# EAGLE schematic Western Aero 2020 (EAGLE 9.4.2)
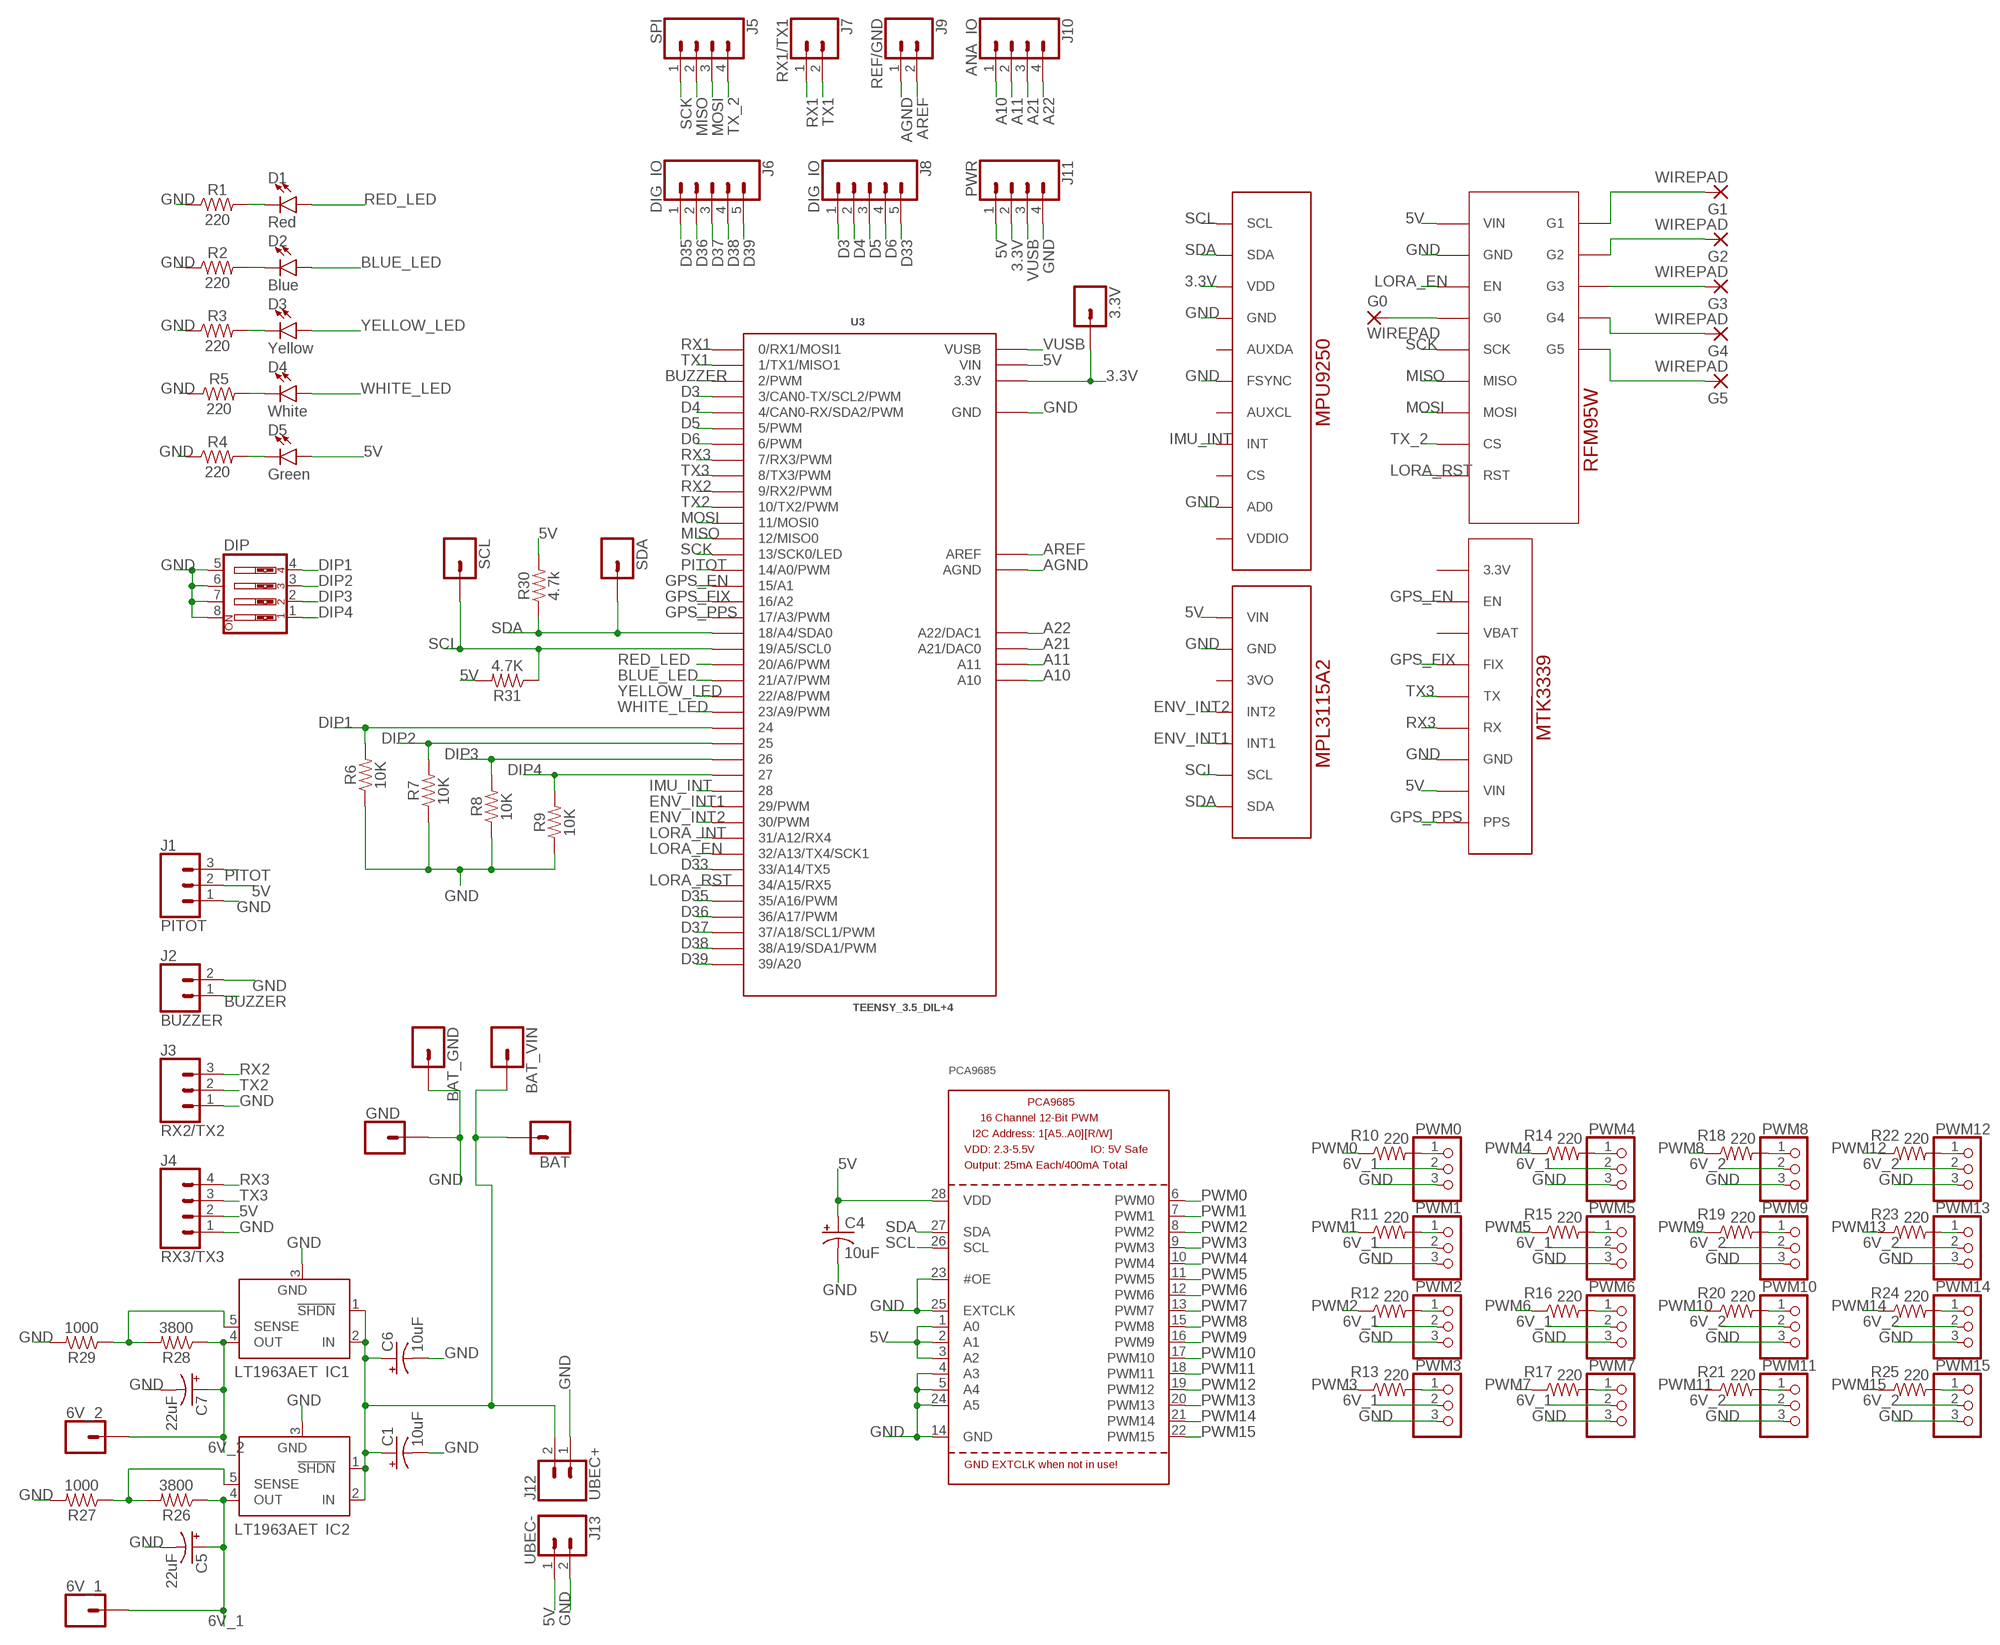
[diagram p0: schematic, sheet 1]

## Parts
3.3V  CONN_01  [1X01]
6V_1  CONN_01  [1X01]
6V_2  CONN_01  [1X01]
BAT  CONN_01  [1X01]
BAT_GND  CONN_01  [1X01]
BAT_VIN  CONN_01  [1X01]
C1  10uF  10UF-POLAR-RADIAL-2.5MM-25V-20%  [CPOL-RADIAL-2.5MM-5MM]
C4  10uF  10UF-POLAR-RADIAL-2.5MM-25V-20%  [CPOL-RADIAL-2.5MM-5MM]
C5  22uF  10UF-POLAR-RADIAL-2.5MM-25V-20%  [CPOL-RADIAL-2.5MM-5MM]
C6  10uF  10UF-POLAR-RADIAL-2.5MM-25V-20%  [CPOL-RADIAL-2.5MM-5MM]
C7  22uF  10UF-POLAR-RADIAL-2.5MM-25V-20%  [CPOL-RADIAL-2.5MM-5MM]
D1  Red  LED3MM  [LED_3MM]
D2  Blue  LED3MM  [LED_3MM]
D3  Yellow  LED3MM  [LED_3MM]
D4  White  LED3MM  [LED_3MM]
D5  Green  LED3MM  [LED_3MM]
DIP  SW_DIP-4  [EDG-04]
G0  WIREPAD  WIREPAD2,15/1,0  [2,15/1,0]
G1  WIREPAD  WIREPAD2,15/1,0  [2,15/1,0]
G2  WIREPAD  WIREPAD2,15/1,0  [2,15/1,0]
G3  WIREPAD  WIREPAD2,15/1,0  [2,15/1,0]
G4  WIREPAD  WIREPAD2,15/1,0  [2,15/1,0]
G5  WIREPAD  WIREPAD2,15/1,0  [2,15/1,0]
GND  CONN_01  [1X01]
IC1  LT1963AET  [TO220-5]
IC2  LT1963AET  [TO220-5]
J1  PITOT  CONN_03  [1X03]
J2  BUZZER  CONN_02  [1X02]
J3  RX2/TX2  CONN_03  [1X03]
J4  RX3/TX3  CONN_04  [1X04]
J5  SPI  CONN_04  [1X04]
J6  DIG_IO  CONN_05  [1X05]
J7  RX1/TX1  CONN_02  [1X02]
J8  DIG_IO  CONN_05  [1X05]
J9  REF/GND  CONN_02  [1X02]
J10  ANA_IO  CONN_04  [1X04]
J11  PWR  CONN_04  [1X04]
J12  UBEC+  CONN_02  [1X02]
J13  UBEC-  CONN_02  [1X02]
JP1  PWM0  PINHD-1X3  [1X03]
JP2  PWM1  PINHD-1X3  [1X03]
JP3  PWM2  PINHD-1X3  [1X03]
JP4  PWM3  PINHD-1X3  [1X03]
JP5  PWM4  PINHD-1X3  [1X03]
JP6  PWM5  PINHD-1X3  [1X03]
JP7  PWM6  PINHD-1X3  [1X03]
JP8  PWM7  PINHD-1X3  [1X03]
JP9  PWM8  PINHD-1X3  [1X03]
JP10  PWM9  PINHD-1X3  [1X03]
JP11  PWM10  PINHD-1X3  [1X03]
JP12  PWM11  PINHD-1X3  [1X03]
JP13  PWM12  PINHD-1X3  [1X03]
JP14  PWM13  PINHD-1X3  [1X03]
JP15  PWM14  PINHD-1X3  [1X03]
JP16  PWM15  PINHD-1X3  [1X03]
PCA9685  PCA9685  [TSSOP28]
R1  220  330OHM-HORIZ-1/10W-5%  [AXIAL-0.3]
R2  220  330OHM-HORIZ-1/10W-5%  [AXIAL-0.3]
R3  220  330OHM-HORIZ-1/10W-5%  [AXIAL-0.3]
R4  220  330OHM-HORIZ-1/10W-5%  [AXIAL-0.3]
R5  220  330OHM-HORIZ-1/10W-5%  [AXIAL-0.3]
R6  10K  330OHM-HORIZ-1/10W-5%  [AXIAL-0.3]
R7  10K  330OHM-HORIZ-1/10W-5%  [AXIAL-0.3]
R8  10K  330OHM-HORIZ-1/10W-5%  [AXIAL-0.3]
R9  10K  330OHM-HORIZ-1/10W-5%  [AXIAL-0.3]
R10  220  330OHM-HORIZ-1/10W-5%  [AXIAL-0.3]
R11  220  330OHM-HORIZ-1/10W-5%  [AXIAL-0.3]
R12  220  330OHM-HORIZ-1/10W-5%  [AXIAL-0.3]
R13  220  330OHM-HORIZ-1/10W-5%  [AXIAL-0.3]
R14  220  330OHM-HORIZ-1/10W-5%  [AXIAL-0.3]
R15  220  330OHM-HORIZ-1/10W-5%  [AXIAL-0.3]
R16  220  330OHM-HORIZ-1/10W-5%  [AXIAL-0.3]
R17  220  330OHM-HORIZ-1/10W-5%  [AXIAL-0.3]
R18  220  330OHM-HORIZ-1/10W-5%  [AXIAL-0.3]
R19  220  330OHM-HORIZ-1/10W-5%  [AXIAL-0.3]
R20  220  330OHM-HORIZ-1/10W-5%  [AXIAL-0.3]
R21  220  330OHM-HORIZ-1/10W-5%  [AXIAL-0.3]
R22  220  330OHM-HORIZ-1/10W-5%  [AXIAL-0.3]
R23  220  330OHM-HORIZ-1/10W-5%  [AXIAL-0.3]
R24  220  330OHM-HORIZ-1/10W-5%  [AXIAL-0.3]
R25  220  330OHM-HORIZ-1/10W-5%  [AXIAL-0.3]
R26  3800  330OHM-HORIZ-1/10W-5%  [AXIAL-0.3]
R27  1000  330OHM-HORIZ-1/10W-5%  [AXIAL-0.3]
R28  3800  330OHM-HORIZ-1/10W-5%  [AXIAL-0.3]
R29  1000  330OHM-HORIZ-1/10W-5%  [AXIAL-0.3]
R30  4.7k  330OHM-HORIZ-1/10W-5%  [AXIAL-0.3]
R31  4.7K  330OHM-HORIZ-1/10W-5%  [AXIAL-0.3]
SCL  CONN_01  [1X01]
SDA  CONN_01  [1X01]
U3  TEENSY_3.5_DIL+4  [TEENSY_3.5_DIL+4]
U5  SPARKFUN_MPU9250_IMU  [SPARKFUN_MPU9250_IMU]
U6  ADAFRUIT_MPL3115A2_BAROMETER  [ADAFRUIT_MPL3115A2_BAROMETER]
U8  ADAFRUIT_RFM95W_LORA_RADIO  [ADAFRUIT_RFM95W_LORA_RADIO]
U9  ADAFRUIT_MTK3339_GPS  [ADAFRUIT_MTK3339_GPS]

## Nets
3.3V: 3.3V.1 J11.2 U3.3.3V U3.3.3V3(3.3V) U5.VDD
5V: C4.1(+) D5.A J1.2 J4.2 J11.1 J13.1 PCA9685.1(A0) PCA9685.2(A1) PCA9685.3(A2) PCA9685.28(VDD) R30.P$2 R31.P$2 U3.VIN U6.VIN U8.1(VIN) U9.VIN
6V_1: 6V_1.1 C5.1(+) IC2.4(OUT) JP1.2 JP2.2 JP3.2 JP4.2 JP5.2 JP6.2 JP7.2 JP8.2 R26.P$1
6V_2: 6V_2.1 C7.1(+) IC1.4(OUT) JP9.2 JP10.2 JP11.2 JP12.2 JP13.2 JP14.2 JP15.2 JP16.2 R28.P$1
A10: J10.1 U3.A10
A11: J10.2 U3.A11
A21: J10.3 U3.A21(A21/DAC0)
A22: J10.4 U3.A22(A22/DAC1)
AGND: J9.1 U3.AGND
AREF: J9.2 U3.AREF
BAT+: BAT.1 BAT_VIN.1 C1.1(+) C6.1(+) IC1.1(!SHDN) IC1.2(IN) IC2.1(!SHDN) IC2.2(IN) J12.2
BLUE_LED: D2.A U3.21/A7(21/A7/PWM)
BUZZER: J2.1 U3.2(2/PWM)
D3: J8.1 U3.3(3/CAN0-TX/SCL2/PWM)
D4: J8.2 U3.4(4/CAN0-RX/SDA2/PWM)
D5: J8.3 U3.5(5/PWM)
D6: J8.4 U3.6(6/PWM)
D33: J8.5 U3.33/A14(33/A14/TX5)
D35: J6.1 U3.35/A16(35/A16/PWM)
D36: J6.2 U3.36/A17(36/A17/PWM)
D37: J6.3 U3.37/A18(37/A18/SCL1/PWM)
D38: J6.4 U3.38/A19(38/A19/SDA1/PWM)
D39: J6.5 U3.39/A20
DIP1: DIP.4 R6.P$2 U3.24
DIP2: DIP.3 R7.P$2 U3.25
DIP3: DIP.2 R8.P$2 U3.26
DIP4: DIP.1 R9.P$2 U3.27
ENV_INT1: U3.29(29/PWM) U6.INT1
ENV_INT2: U3.30(30/PWM) U6.INT2
GND: BAT_GND.1 C1.2(-) C4.2(-) C5.2(-) C6.2(-) C7.2(-) DIP.5 DIP.6 DIP.7 DIP.8 GND.1 IC1.3(GND) IC2.3(GND) J1.1 J2.2 J3.1 J4.1 J11.4 J12.1 J13.2 JP1.3 JP2.3 JP3.3 JP4.3 JP5.3 JP6.3 JP7.3 JP8.3 JP9.3 JP10.3 JP11.3 JP12.3 JP13.3 JP14.3 JP15.3 JP16.3 PCA9685.4(A3) PCA9685.5(A4) PCA9685.14(GND) PCA9685.23(#OE) PCA9685.24(A5) PCA9685.25(EXTCLK) R1.P$1 R2.P$1 R3.P$1 R4.P$1 R5.P$1 R6.P$1 R7.P$1 R8.P$1 R9.P$1 R27.P$2 R29.P$2 U3.GND U3.GND1(GND) U5.AD0 U5.FSYNC U5.GND U6.GND U8.2(GND) U9.GND
GPS_EN: U3.15/A1 U9.EN
GPS_FIX: U3.16/A2 U9.FIX
GPS_PPS: U3.17/A3(17/A3/PWM) U9.PPS
IMU_INT: U3.28 U5.INT
LORA_EN: U3.32/A13(32/A13/TX4/SCK1) U8.3(EN)
LORA_INT: U3.31/A12(31/A12/RX4)
LORA_RST: U3.34/A15(34/A15/RX5) U8.9(RST)
MISO: J5.2 U3.12(12/MISO0) U8.6(MISO)
MOSI: J5.3 U3.11(11/MOSI0) U8.7(MOSI)
N$1: JP1.1 R10.P$2
N$2: D1.K(C) R1.P$2
N$3: D2.K(C) R2.P$2
N$4: D3.K(C) R3.P$2
N$5: D4.K(C) R5.P$2
N$6: D5.K(C) R4.P$2
N$7: G5.1(P) U8.14(G5)
N$8: G1.1(P) U8.10(G1)
N$9: JP2.1 R11.P$2
N$10: G2.1(P) U8.11(G2)
N$11: JP3.1 R12.P$2
N$12: JP4.1 R13.P$2
N$13: JP5.1 R14.P$2
N$14: JP6.1 R15.P$2
N$15: JP7.1 R16.P$2
N$16: JP8.1 R17.P$2
N$17: JP9.1 R18.P$2
N$18: JP10.1 R19.P$2
N$19: JP11.1 R20.P$2
N$20: JP12.1 R21.P$2
N$21: JP13.1 R22.P$2
N$22: JP14.1 R23.P$2
N$23: JP15.1 R24.P$2
N$24: JP16.1 R25.P$2
N$25: G4.1(P) U8.13(G4)
N$26: G3.1(P) U8.12(G3)
N$27: G0.1(P) U8.4(G0)
N$28: IC1.5(SENSE) R28.P$2 R29.P$1
N$29: IC2.5(SENSE) R26.P$2 R27.P$1
PITOT: J1.3 U3.14/A0(14/A0/PWM)
PWM0: PCA9685.6(PWM0) R10.P$1
PWM1: PCA9685.7(PWM1) R11.P$1
PWM2: PCA9685.8(PWM2) R12.P$1
PWM3: PCA9685.9(PWM3) R13.P$1
PWM4: PCA9685.10(PWM4) R14.P$1
PWM5: PCA9685.11(PWM5) R15.P$1
PWM6: PCA9685.12(PWM6) R16.P$1
PWM7: PCA9685.13(PWM7) R17.P$1
PWM8: PCA9685.15(PWM8) R18.P$1
PWM9: PCA9685.16(PWM9) R19.P$1
PWM10: PCA9685.17(PWM10) R20.P$1
PWM11: PCA9685.18(PWM11) R21.P$1
PWM12: PCA9685.19(PWM12) R22.P$1
PWM13: PCA9685.20(PWM13) R23.P$1
PWM14: PCA9685.21(PWM14) R24.P$1
PWM15: PCA9685.22(PWM15) R25.P$1
RED_LED: D1.A U3.20/A6(20/A6/PWM)
RX1: J7.1 U3.0(0/RX1/MOSI1)
RX2: J3.3 U3.9(9/RX2/PWM)
RX3: J4.4 U3.7(7/RX3/PWM) U9.RX
SCK: J5.1 U3.13(13/SCK0/LED) U8.5(SCK)
SCL: PCA9685.26(SCL) R31.P$1 SCL.1 U3.19/A5(19/A5/SCL0) U5.SCL U6.SCL
SDA: PCA9685.27(SDA) R30.P$1 SDA.1 U3.18/A4(18/A4/SDA0) U5.SDA U6.SDA
TX1: J7.2 U3.1(1/TX1/MISO1)
TX2: J3.2 U3.10(10/TX2/PWM)
TX3: J4.3 U3.8(8/TX3/PWM) U9.TX
TX_2: J5.4 U8.8(CS)
VUSB: J11.3 U3.VUSB
WHITE_LED: D4.A U3.23/A9(23/A9/PWM)
YELLOW_LED: D3.A U3.22/A8(22/A8/PWM)
Unconnected: U5.AUXCL U5.AUXDA U5.CS U5.VDDIO U6.3VO U9.3.3V U9.VBAT

## Library data of the parts
3.3V 6V_1 6V_2 BAT BAT_GND BAT_VIN GND SCL SDA = SparkFun-Connectors:CONN_01: Single connection point. Often used as Generic Header-pin footprint for 0.1 inch spaced/style header connections On any of the 0.1 inch spaced packages, you can populate with these: Break Away Headers - Straight <https://www.sparkfun.com/products/116> (PRT-00116) Break Away Male Headers - Right Angle <https://www.sparkfun.com/products/553> (PRT-00553) Female Headers <https://www.sparkfun.com/products/115> (PRT-00115) Break Away Headers - Machine Pin <https://www.sparkfun.com/products/117> (PRT-00117) Break Away Female Headers - Swiss Machine Pin <https://www.sparkfun.com/products/743> (PRT-00743) This device is also useful as a general connection point to wire up your design to another part of your project. Our various solder wires solder well into these plated through hole pads. Hook-Up Wire - Assortment (Stranded, 22 AWG) <https://www.sparkfun.com/products/11375> (PRT-11375) Hook-Up Wire - Assortment (Solid Core, 22 AWG) <https://www.sparkfun.com/products/11367> (PRT-11367) View the entire wire category on our website here <https://www.sparkfun.com/categories/141> Special notes: SMTSO-256-ET is a "flush mount" nut for a 4-40 screw. We mostly use this on specialty testbeds; it is a nice way to connect hardware to your PCB at an adjustable hieght. Also note, the SNAP packages are for using a snappable style connector. We sell a baggie of snaps and they are also used on two LilyPad designs: Snap Assortment - 30 pack (male and female) <https://www.sparkfun.com/products/11347> (DEV-11347) LilyPad Arduino SimpleSnap <https://www.sparkfun.com/products/10941> (DEV-10941) LilyPad SimpleSnap Protoboard <https://www.sparkfun.com/products/10940> (DEV-10940)
C1 C4 C6 = SparkFun-Capacitors:10UF-POLAR: 10.0µF polarized capacitors A capacitor is a passive two-terminal electrical component used to store electrical energy temporarily in an electric field.; PROD_ID: CAP-08440
C5 C7 = SparkFun-Capacitors:10UF-POLAR: 10.0µF polarized capacitors A capacitor is a passive two-terminal electrical component used to store electrical energy temporarily in an electric field.; PROD_ID: CAP-08440; VALUE: 10uF
D1-D5 = SparkFun-LED:LED: LED (Generic) Standard schematic elements and footprints for 5mm, 3mm, 1206, and 0603 sized LEDs. Generic LEDs with no color specified.; PROD_ID: DIO-08794
DIP = special:SW_DIP-4: DIP SWITCH
G0 G1-G5 = wirepad:WIREPAD: Wire PAD connect wire on PCB
IC1 IC2 = linear-technology:LT1963AET*: LT1963 1.5A, Low Noise, Fast Transient Response LDO Regulator Source: http://www.linear.com; MPN: LT1963AET; OC_FARNELL: 1273631; OC_NEWARK: 57M7482
J1 J3 = SparkFun-Connectors:CONN_03: Multi connection point. Often used as Generic Header-pin footprint for 0.1 inch spaced/style header connections On any of the 0.1 inch spaced packages, you can populate with these: Break Away Headers - Straight <https://www.sparkfun.com/products/116> (PRT-00116) Break Away Male Headers - Right Angle <https://www.sparkfun.com/products/553> (PRT-00553) Female Headers <https://www.sparkfun.com/products/115> (PRT-00115) Break Away Headers - Machine Pin <https://www.sparkfun.com/products/117> (PRT-00117) Break Away Female Headers - Swiss Machine Pin <https://www.sparkfun.com/products/743> (PRT-00743) Stackable Header - 3 Pin (Female, 0.1") <https://www.sparkfun.com/products/13875> (PRT-13875) For SCREWTERMINALS and SPRING TERMINALS visit here: Screw Terimnals on SparkFun.com <https://www.sparkfun.com/search/results?term=Screw+Terminals> (5mm/3.5mm/2.54mm spacing) This device is also useful as a general connection point to wire up your design to another part of your project. Our various solder wires solder well into these plated through hole pads. Hook-Up Wire - Assortment (Stranded, 22 AWG) <https://www.sparkfun.com/products/11375> (PRT-11375) Hook-Up Wire - Assortment (Solid Core, 22 AWG) <https://www.sparkfun.com/products/11367> (PRT-11367) View the entire wire category on our website here <https://www.sparkfun.com/categories/141> Special notes: Molex polarized connector foot print use with SKU : PRT-08232 with associated crimp pins and housings.
J2 J7 J9 J12 J13 = SparkFun-Connectors:CONN_02: Multi connection point. Often used as Generic Header-pin footprint for 0.1 inch spaced/style header connections On any of the 0.1 inch spaced packages, you can populate with these: Break Away Headers - Straight <https://www.sparkfun.com/products/116> (PRT-00116) Break Away Male Headers - Right Angle <https://www.sparkfun.com/products/553> (PRT-00553) Female Headers <https://www.sparkfun.com/products/115> (PRT-00115) Break Away Headers - Machine Pin <https://www.sparkfun.com/products/117> (PRT-00117) Break Away Female Headers - Swiss Machine Pin <https://www.sparkfun.com/products/743> (PRT-00743) For SCREWTERMINALS and SPRING TERMINALS visit here: Screw Terimnals on SparkFun.com <https://www.sparkfun.com/search/results?term=Screw+Terminals> (5mm/3.5mm/2.54mm spacing) This device is also useful as a general connection point to wire up your design to another part of your project. Our various solder wires solder well into these plated through hole pads. Hook-Up Wire - Assortment (Stranded, 22 AWG) <https://www.sparkfun.com/products/11375> (PRT-11375) Hook-Up Wire - Assortment (Solid Core, 22 AWG) <https://www.sparkfun.com/products/11367> (PRT-11367) View the entire wire category on our website here <https://www.sparkfun.com/categories/141> Special notes: Molex polarized connector foot print use with: PRT-08233 with associated crimp pins and housings. 2.54_SCREWTERM for use with PRT-10571. 3.5mm Screw Terminal footprints for PRT-08084 5mm Screw Terminal footprints for use with PRT-08432
J4 J5 J10 J11 = SparkFun-Connectors:CONN_04: Multi connection point. Often used as Generic Header-pin footprint for 0.1 inch spaced/style header connections On any of the 0.1 inch spaced packages, you can populate with these: Break Away Headers - Straight <https://www.sparkfun.com/products/116> (PRT-00116) Break Away Male Headers - Right Angle <https://www.sparkfun.com/products/553> (PRT-00553) Female Headers <https://www.sparkfun.com/products/115> (PRT-00115) Break Away Headers - Machine Pin <https://www.sparkfun.com/products/117> (PRT-00117) Break Away Female Headers - Swiss Machine Pin <https://www.sparkfun.com/products/743> (PRT-00743) For SCREWTERMINALS and SPRING TERMINALS visit here: Screw Terimnals on SparkFun.com <https://www.sparkfun.com/search/results?term=Screw+Terminals> (5mm/3.5mm/2.54mm spacing) This device is also useful as a general connection point to wire up your design to another part of your project. Our various solder wires solder well into these plated through hole pads. Hook-Up Wire - Assortment (Stranded, 22 AWG) <https://www.sparkfun.com/products/11375> (PRT-11375) Hook-Up Wire - Assortment (Solid Core, 22 AWG) <https://www.sparkfun.com/products/11367> (PRT-11367) View the entire wire category on our website here <https://www.sparkfun.com/categories/141> Special notes: Molex polarized connector foot print use with SKU : PRT-08231 with associated crimp pins and housings. 1MM SMD Version SKU: PRT-10208; PROD_ID: CONN-09696
J6 J8 = SparkFun-Connectors:CONN_05: Multi connection point. Often used as Generic Header-pin footprint for 0.1 inch spaced/style header connections On any of the 0.1 inch spaced packages, you can populate with these: Break Away Headers - Straight <https://www.sparkfun.com/products/116> (PRT-00116) Break Away Male Headers - Right Angle <https://www.sparkfun.com/products/553> (PRT-00553) Female Headers <https://www.sparkfun.com/products/115> (PRT-00115) Break Away Headers - Machine Pin <https://www.sparkfun.com/products/117> (PRT-00117) Break Away Female Headers - Swiss Machine Pin <https://www.sparkfun.com/products/743> (PRT-00743) For SCREWTERMINALS and SPRING TERMINALS visit here: Screw Terimnals on SparkFun.com <https://www.sparkfun.com/search/results?term=Screw+Terminals> (5mm/3.5mm/2.54mm spacing) This device is also useful as a general connection point to wire up your design to another part of your project. Our various solder wires solder well into these plated through hole pads. Hook-Up Wire - Assortment (Stranded, 22 AWG) <https://www.sparkfun.com/products/11375> (PRT-11375) Hook-Up Wire - Assortment (Solid Core, 22 AWG) <https://www.sparkfun.com/products/11367> (PRT-11367) View the entire wire category on our website here <https://www.sparkfun.com/categories/141> Special notes: Molex polarized connector foot print use with SKU : PRT-08231 with associated crimp pins and housings. 1MM SMD Version SKU: PRT-10208
JP1-JP16 = pinhead:PINHD-1X3: PIN HEADER
PCA9685 = adafruit:PCA9685: PCA9685 - 16 Channel 12-Bit I2C PWM Controller 5.0V tolerant 16 channel, 12-bit I2C PWM controller with 25mA per output (max. 400mA total) Digikey: 568-5931-1-ND
R1-R31 = SparkFun-Resistors:330OHM: 330Ω resistor A resistor is a passive two-terminal electrical component that implements electrical resistance as a circuit element. Resistors act to reduce current flow, and, at the same time, act to lower voltage levels within circuits. - Wikipedia; PROD_ID: RES-8371; VALUE: 330
U3 = Teensy_3_and_LC_Series_Boards_v1.4:TEENSY_3.5_DIL+4: DIL version of Teensy 3.5 plus the VUSB/A10/A11/AREF PINS
U5 = AERO_Eagle_Library:SPARKFUN_MPU9250_IMU: Sparkfun's 9-DOF IMU: MPU9250 https://www.sparkfun.com/products/13762
U6 = AERO_Eagle_Library:ADAFRUIT_MPL3115A2_BAROMETER: Adafruit's Barometer and Environment Sensing: MPL3115A2 https://www.adafruit.com/product/1893
U8 = AERO_Eagle_Library:ADAFRUIT_RFM95W_LORA_RADIO: Adafruit's LoRa Radio: RFM95W https://www.adafruit.com/product/3072
U9 = AERO_Eagle_Library:ADAFRUIT_MTK3339_GPS: Adafruit's Ultimate GPS Breakout: MTK3339 https://www.adafruit.com/product/746